# Altium schematic sheet 06-LogicNOT.SchDoc
size A4
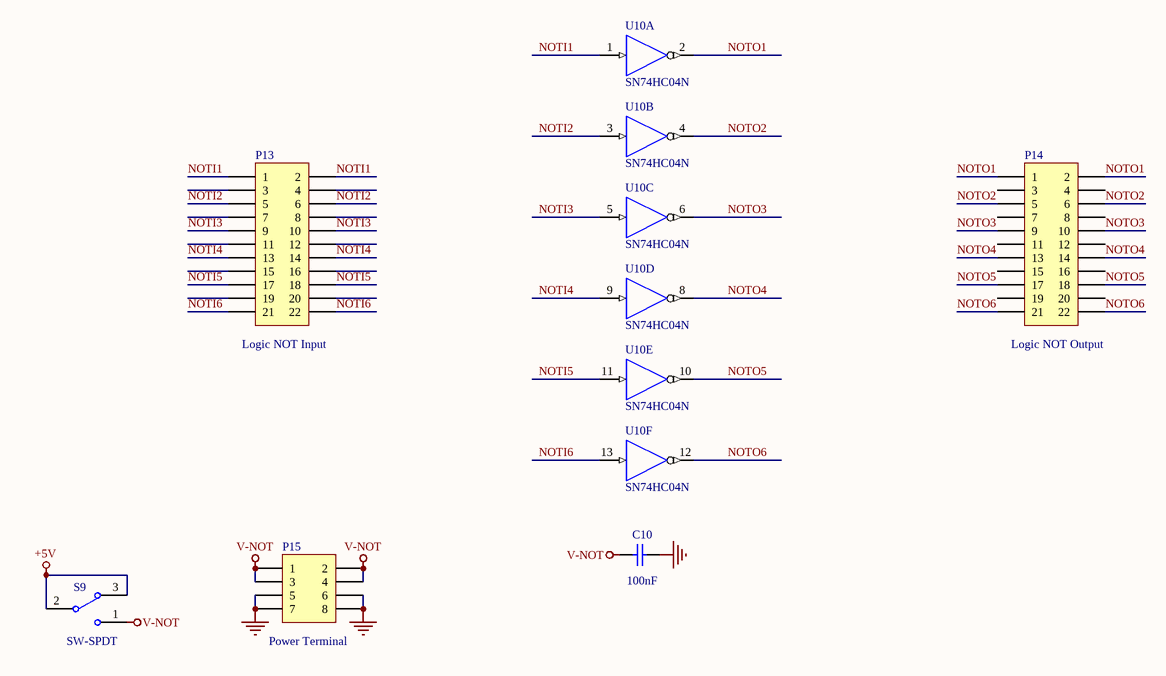
[diagram p0: 06-LogicNOT.SchDoc]

## Parts
C10  value 100nF  [C-0805]  (hidden comment: 104)
P13  value Logic NOT Input  [HDR2X11]  (hidden comment: Header 11X2)
P14  value Logic NOT Output  [HDR2X11]  (hidden comment: Header 11X2)
P15  Publisher: Power Terminal  [HDR2X4]  (hidden comment: Header 4X2)
S9  SW-SPDT  [SW-DIP1SMD]
U10  SN74HC04N  [SK-DIP14-300]  (parts A,B,C,D,E,F of 6)

## Nets
+5V: S9.2 S9.3
GND: C10.2 P15.5 P15.6 P15.7 P15.8 U10.7(GND)
V-NOT: C10.1 P15.1 P15.2 P15.3 P15.4 S9.1
VCC: U10.14(V-NOT)
NOTI1: P13.1 P13.2 U10.1(A)
NOTI2: P13.5 P13.6 U10.3(A)
NOTI3: P13.9 P13.10 U10.5(A)
NOTI4: P13.13 P13.14 U10.9(A)
NOTI5: P13.17 P13.18 U10.11(A)
NOTI6: P13.21 P13.22 U10.13(A)
NOTO1: P14.1 P14.2 U10.2(Y)
NOTO2: P14.5 P14.6 U10.4(Y)
NOTO3: P14.9 P14.10 U10.6(Y)
NOTO4: P14.13 P14.14 U10.8(Y)
NOTO5: P14.17 P14.18 U10.10(Y)
NOTO6: P14.21 P14.22 U10.12(Y)

Not connected (* = marked no-connect by the designer): P13 3 4 7 8 11 12 15 16 19 20; P14 3 4 7 8 11 12 15 16 19 20

## Library data of the parts
C10 = Cap: Capacitor; Published: 8-Jun-2000; LatestRevisionDate: 17-Jul-2002; LatestRevisionNote: Re-released for DXP Platform.; PackageReference: RAD-0.3; Publisher: Altium Limited; PackageDescription: Radial Cap, Thru-Hole; 2 Leads; 0.3 in Pin Spacing
P13 P14 = Header 11X2: Header, 11-Pin, Dual row; LatestRevisionDate: 17-Jul-2002; LatestRevisionNote: Re-released for DXP Platform.
P15 = Header 4X2: Header, 4-Pin, Dual row; LatestRevisionDate: 17-Jul-2002; LatestRevisionNote: Re-released for DXP Platform.
S9 = SW-SPDT: SPDT Subminiature Toggle Switch, Right Angle Mounting, Vertical Actuation; Published: 24-Mar-1999; LatestRevisionDate: 17-Dec-2003; LatestRevisionNote: Schematic revised, PCB Footprint replaced.; DatasheetVersion: 05-Dec-2000; PackageReference: TL36WW15050; Publisher: Altium Limited; PackageDescription: Switch; 4 Leads; ComponentLink1Description: Manufacturer Link; ComponentLink1URL: http://www.apem.com
U10 = SN74HC04N: Hex Inverter; Published: 8-Jun-2000; LatestRevisionDate: 04-Mar-2005; LatestRevisionNote: Stylized 3D Model Added.; DatasheetVersion: May-1997; PackageVersion: Oct-1995; PackageReference: N014; Publisher: Altium Limited; PackageDescription: DIP; 14 Leads; Row Spacing 7.62 mm; Pitch 2.54 mm; ComponentLink1Description: Manufacturer Link; ComponentLink1URL: http://www.ti.com/; ComponentLink2Description: Datasheet; ComponentLink2URL: http://www-s.ti.com/sc/ds/sn74hc04.pdf